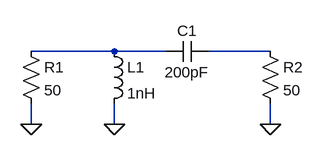
[diagram p0: schematic Draft2.asc]
Draft2.asc, the LTspice schematic file:
Version 4
SHEET 1 880 680
WIRE 288 96 160 96
WIRE 368 96 288 96
WIRE 528 96 432 96
WIRE 160 208 160 176
WIRE 288 208 288 176
WIRE 528 208 528 176
FLAG 160 208 0
FLAG 288 208 0
FLAG 528 208 0
SYMBOL res 144 80 R0
SYMATTR InstName R1
SYMATTR Value 50
SYMBOL ind 272 80 R0
SYMATTR InstName L1
SYMATTR Value 1nH
SYMBOL cap 432 80 R90
WINDOW 0 0 32 VBottom 2
WINDOW 3 32 32 VTop 2
SYMATTR InstName C1
SYMATTR Value 200pF
SYMBOL res 512 80 R0
SYMATTR InstName R2
SYMATTR Value 50

The netlist it stands for:
* Draft2.asc
R1 N001 0 50
L1 N001 0 1nH
C1 N002 N001 200pF
R2 N002 0 50
.backanno
.end